# EAGLE design sensor garis (EAGLE 7.1.0)
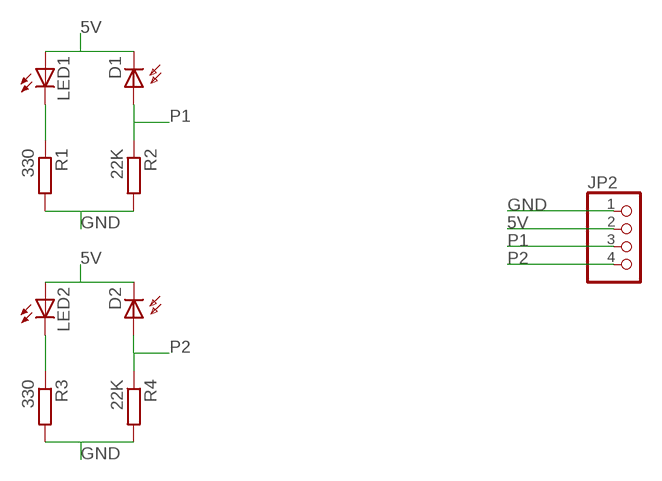
[diagram p0: schematic, sheet 1]

## Parts
D1  BPX65  [BPX65]
D2  BPX65  [BPX65]
JP2  PINHD-1X4  [1X04]
LED1  LED3MM  [LED3MM]
LED2  LED3MM  [LED3MM]
R1  330  R-EU_0207/7  [0207/7]
R2  22K  R-EU_0207/7  [0207/7]
R3  330  R-EU_0207/7  [0207/7]
R4  22K  R-EU_0207/7  [0207/7]

## Nets
5V: D1.K(C) D2.K(C) JP2.2 LED1.A LED2.A
GND: JP2.1 R1.2 R2.2 R3.2 R4.2
N$1: LED2.K(C) R3.1
N$2: LED1.K(C) R1.1
P1: D1.A JP2.3 R2.1
P2: D2.A JP2.4 R4.1

## Library data of the parts
D1 D2 = opto-trans-siemens:BPX65: PHOTO DIODE; MPN: BPX65.; OC_FARNELL: 327451; OC_NEWARK: 06WX2764
JP2 = pinhead:PINHD-1X4: PIN HEADER
LED1 LED2 = led:LED: LED OSRAM: - CHIPLED LG R971, LG N971, LY N971, LG Q971, LY Q971, LO R971, LY R971 LH N974, LH R974 LS Q976, LO Q976, LY Q976 LO Q996 - Hyper CHIPLED LW Q18S LB Q993, LB Q99A, LB R99A - SideLED LS A670, LO A670, LY A670, LG A670, LP A670 LB A673, LV A673, LT A673, LW A673 LH A674 LY A675 LS A676, LA A676, LO A676, LY A676, LW A676 LS A679, LY A679, LG A679 - Hyper Micro SIDELED® LS Y876, LA Y876, LO Y876, LY Y876 LT Y87S - SmartLED LW L88C, LW L88S LB L89C, LB L89S, LG L890 LS L89K, LO L89K, LY L89K LS L896, LA L896, LO L896, LY L896 - TOPLED LS T670, LO T670, LY T670, LG T670, LP T670 LSG T670, LSP T670, LSY T670, LOP T670, LYG T670 LG T671, LOG T671, LSG T671 LB T673, LV T673, LT T673, LW T673 LH T674 LS T676, LA T676, LO T676, LY T676, LB T676, LH T676, LSB T676, LW T676 LB T67C, LV T67C, LT T67C, LS T67K, LO T67K, LY T67K, LW E67C LS E67B, LA E67B, LO E67B, LY E67B, LB E67C, LV E67C, LT E67C LW T67C LS T679, LY T679, LG T679 LS T770, LO T770, LY T770, LG T770, LP T770 LB T773, LV T773, LT T773, LW T773 LH T774 LS E675, LA E675, LY E675, LS T675 LS T776, LA T776, LO T776, LY T776, LB T776 LHGB T686 LT T68C, LB T68C - Hyper Mini TOPLED® LB M676 - Mini TOPLED Santana® LG M470 LS M47K, LO M47K, LY M47K Source: http://www.osram.convergy.de LUXEON: - LUMILED® LXK2-PW12-R00, LXK2-PW12-S00, LXK2-PW14-U00, LXK2-PW14-V00 LXK2-PM12-R00, LXK2-PM12-S00, LXK2-PM14-U00 LXK2-PE12-Q00, LXK2-PE12-R00, LXK2-PE12-S00, LXK2-PE14-T00, LXK2-PE14-U00 LXK2-PB12-K00, LXK2-PB12-L00, LXK2-PB12-M00, LXK2-PB14-N00, LXK2-PB14-P00, LXK2-PB14-Q00 LXK2-PR12-L00, LXK2-PR12-M00, LXK2-PR14-Q00, LXK2-PR14-R00 LXK2-PD12-Q00, LXK2-PD12-R00, LXK2-PD12-S00 LXK2-PH12-R00, LXK2-PH12-S00 LXK2-PL12-P00, LXK2-PL12-Q00, LXK2-PL12-R00 Source: www.luxeon.com KINGBRIGHT: KA-3528ASYC Source: www.kingbright.com
R1-R4 = rcl:R-EU_: RESISTOR, European symbol

## Board
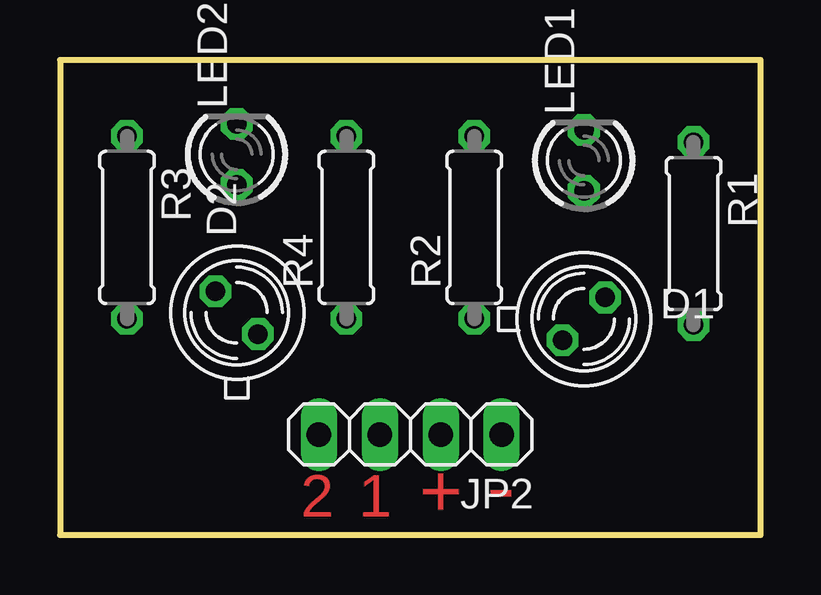
[diagram p1: board, top side]
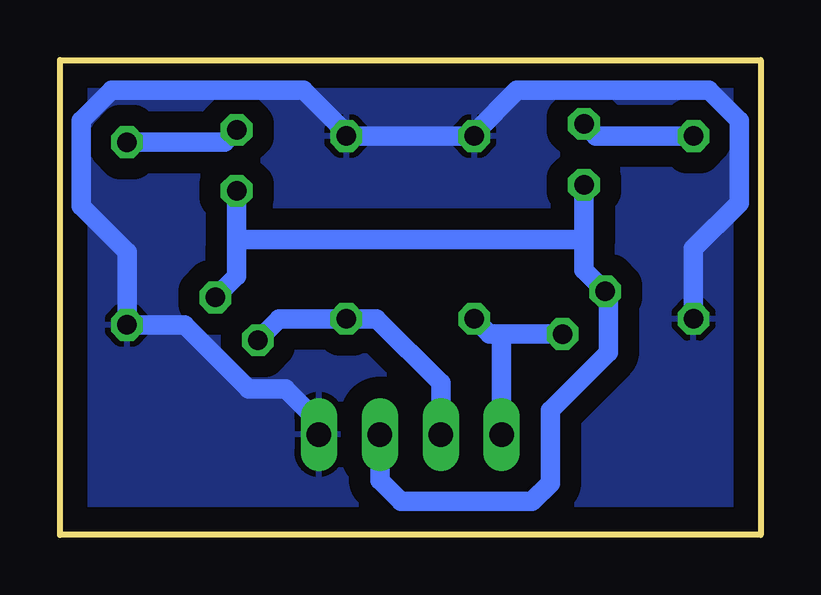
[diagram p2: board, bottom side, seen from below]

Size 29.21 x 19.81 mm. Coordinates in mm from the lower left corner, seen from the top.
Outline: 0,19.81 0,0 29.21,0 29.21,19.81 0,19.81
Copper layers (1*16): Top 0.035mm / dielectric 1.5mm / Bottom 0.035mm
Design rules "default *": minimum track width 10mil, minimum drill 24mil, track to track 35mil, track to pad 35mil, pad to pad 8mil, via to via 8mil, smd to smd 8mil, copper to edge 40mil, drill to drill 8mil, minimum pad ring 10mil, minimum via ring 8mil, stop-mask expansion 4mil, vias tented up to drill 0mil, thermal gap 10mil

### Footprints (pad centres in the part's own frame; a part is rotated, then mirrored left to right if it is on the bottom)
BPX65 = drill 0.813 octagon: A -0.889,-0.889; K 0.889,0.889
1X04 = drill 1.016 long: 1 -3.81,0; 2 -1.27,0; 3 1.27,0; 4 3.81,0
LED3MM = drill 0.813 octagon: A -1.27,0; K 1.27,0
0207/7 = drill 0.813 octagon: 1 -3.81,0; 2 3.81,0

### Placement (x,y rotation side)
D1  21.84,9.02 0 top
D2  7.37,9.27 90 top
JP2  14.6,4.19 180 top
LED1  21.84,15.62 90 top
LED2  7.37,15.88 90 top
R1  26.42,12.57 270 top
R2  17.27,12.83 90 top
R3  2.79,12.83 270 top
R4  11.94,12.83 90 top

### Tracks (layer width: path | path; a pad name or v marks a point on that pad's centre or on a via)
5V
  Bottom 0.813: LED2.A 7.37,12.32 | 7.37,12.32 7.37,11.05 D2.K 6.35,10.03 6.35,7.62 8.76,5.21 8.76,2.16 9.52,1.4 14.99,1.4 15.88,2.29 JP2.2 | 7.37,12.32 21.59,12.32 21.84,12.06 | LED1.A 21.84,12.06 | D1.K 21.84,10.79 21.84,12.06
GND
  Bottom 0.813: JP2.1 18.41,4.7 19.81,6.1 21.34,6.1 24,8.76 R1.2 26.42,11.81 28.32,13.72 28.32,17.27 27.05,18.54 19.05,18.54 17.27,16.76 R2.2 R4.2 11.94,16.76 10.16,18.54 2.16,18.54 0.89,17.27 0.89,13.84 2.79,11.94 R3.2
  pour Bottom: 0,19.69 29.21,19.69 29.08,0 0.13,0
N$1
  Bottom 0.813: R3.1 6.86,16.64 LED2.K
N$2
  Bottom 0.813: R1.1 22.35,16.38 LED1.K
P1
  Bottom 0.813: JP2.3 13.34,6.35 16,9.02 R2.1 20.07,9.02 D1.A
P2
  Bottom 0.813: D2.A 10.8,8.38 | 10.8,8.38 11.3,8.38 R4.1 | JP2.4 10.8,8.38

### Text on the board
Top: 2 | 1 | + | -